# EAGLE design adc_40MHz_v3 (EAGLE 7.6.0)
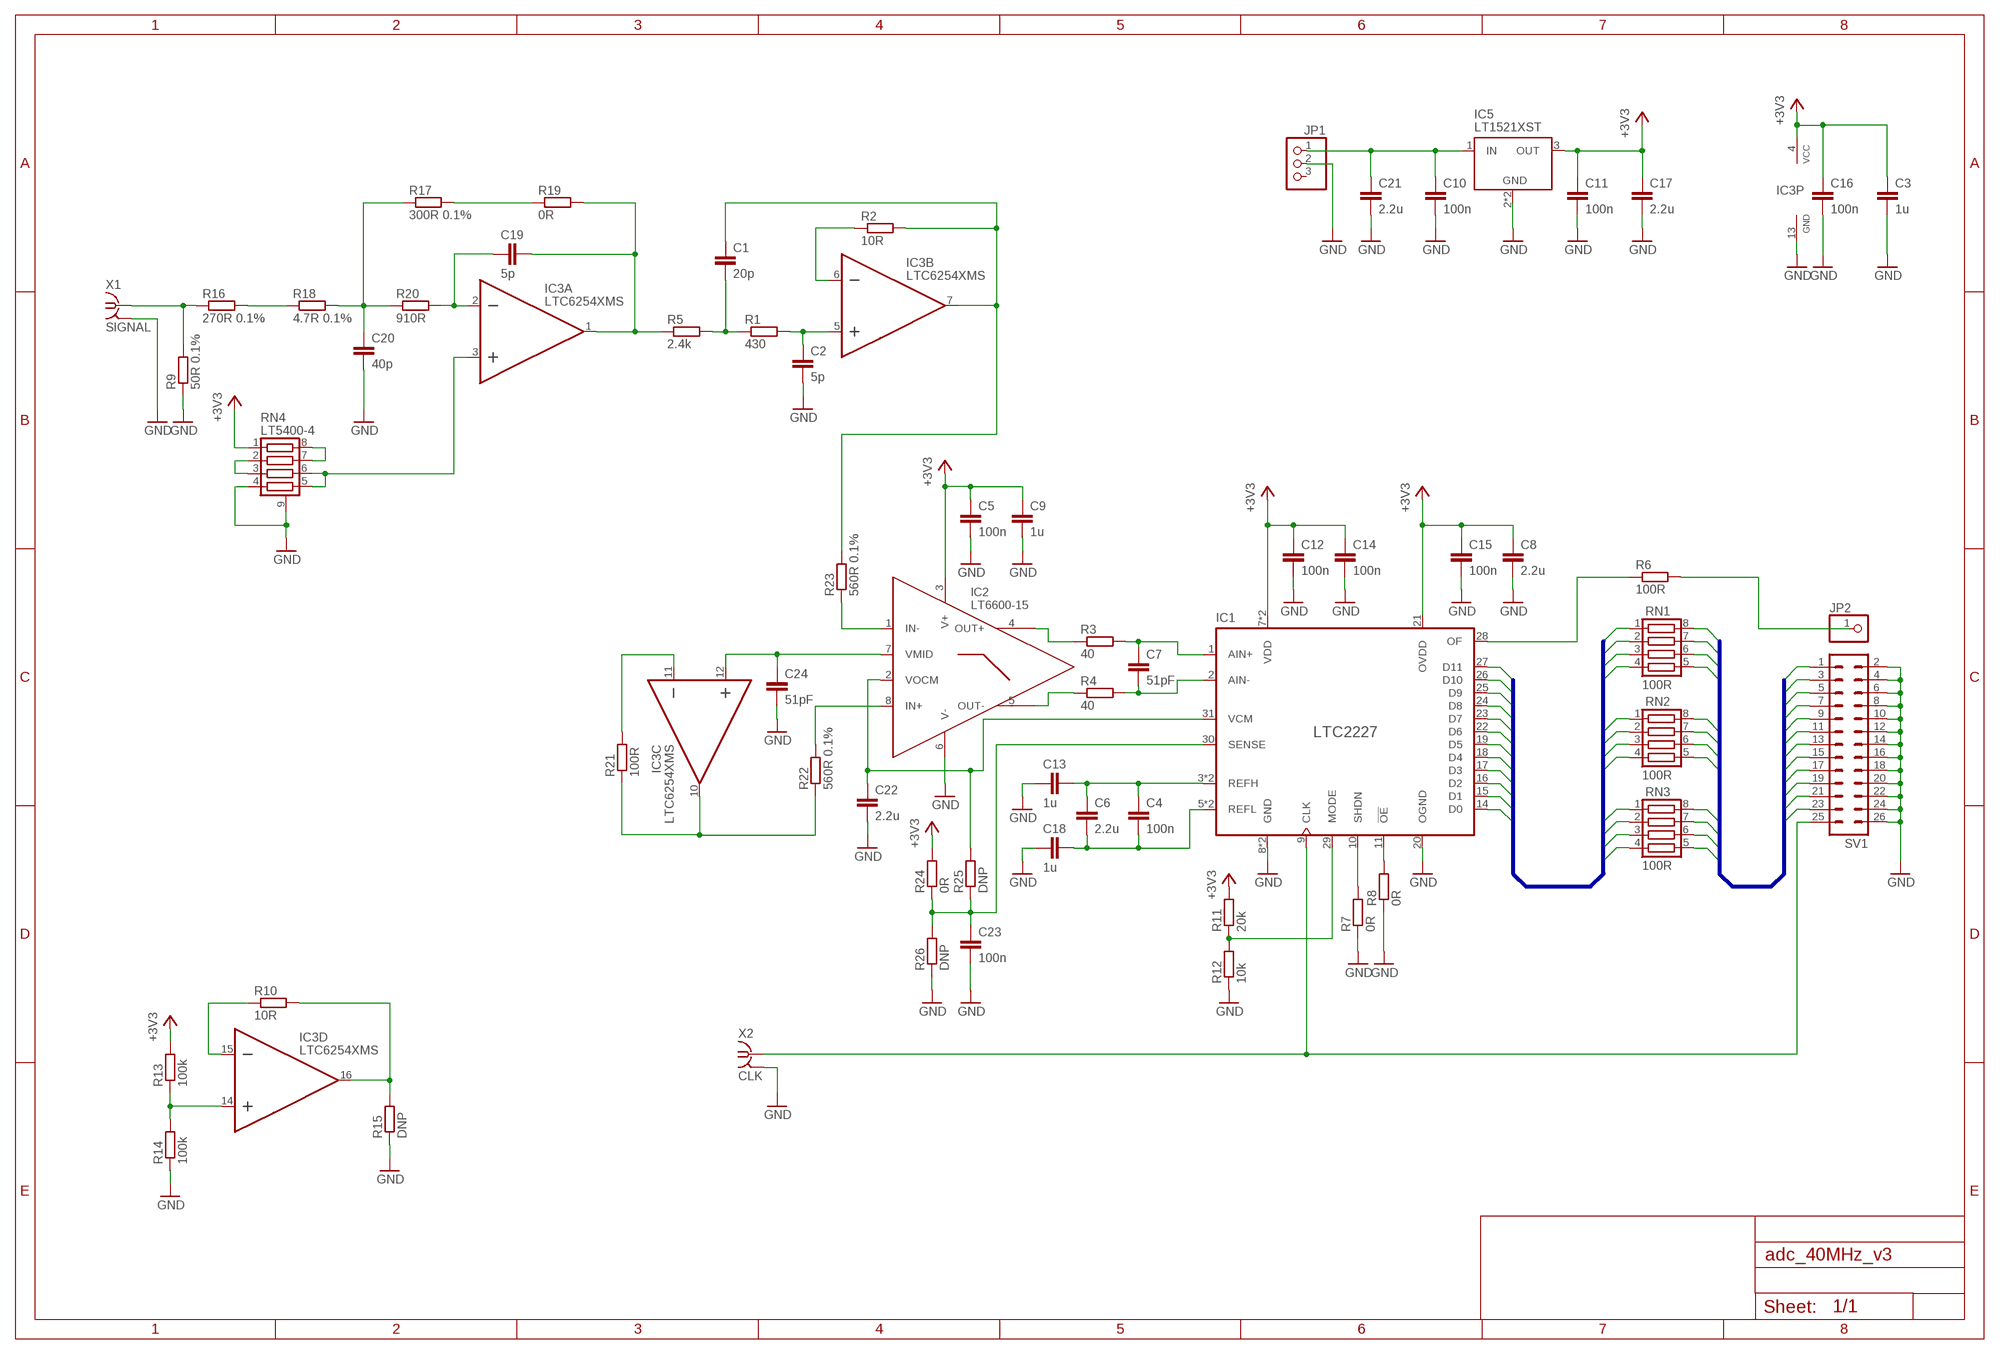
[diagram p0: schematic, sheet 1]

## Parts
C1  20p  C-EUC0603  [C0603]
C2  5p  C-EUC0603  [C0603]
C3  1u  C-EUC0805  [C0805]
C4  100n  C-EUC0603  [C0603]
C5  100n  C-EUC0603  [C0603]
C6  2.2u  C-EUC0805  [C0805]
C7  51pF  C-EUC0603  [C0603]
C8  2.2u  C-EUC0805  [C0805]
C9  1u  C-EUC0805  [C0805]
C10  100n  C-EUC0805  [C0805]
C11  100n  C-EUC0805  [C0805]
C12  100n  C-EUC0603  [C0603]
C13  1u  C-EUC0805  [C0805]
C14  100n  C-EUC0603  [C0603]
C15  100n  C-EUC0603  [C0603]
C16  100n  C-EUC0805  [C0805]
C17  2.2u  C-EUC0805  [C0805]
C18  1u  C-EUC0805  [C0805]
C19  5p  C-EUC0603  [C0603]
C20  40p  C-EUC0603  [C0603]
C21  2.2u  C-EUC0805  [C0805]
C22  2.2u  C-EUC0805  [C0805]
C23  100n  C-EUC0603  [C0603]
C24  51pF  C-EUC0603  [C0603]
IC1  LTC2227  [QFN32]
IC2  LT6600-15  [S8]
IC3  LTC6254XMS  [MSOP16]
IC5  LT1521XST  [SOT223]
JP1  PINHD-1X3/90  [1X03/90]
JP2  PINHD-1X1  [1X01]
R1  430  R-EU_R0603  [R0603]
R2  10R  R-EU_R0603  [R0603]
R3  40  R-EU_R0603  [R0603]
R4  40  R-EU_R0603  [R0603]
R5  2.4k  R-EU_R0603  [R0603]
R6  100R  R-EU_R0603  [R0603]
R7  0R  R-EU_R0603  [R0603]
R8  0R  R-EU_R0603  [R0603]
R9  50R 0.1%  R-EU_R0603  [R0603]
R10  10R  R-EU_R0603  [R0603]
R11  20k  R-EU_R0603  [R0603]
R12  10k  R-EU_R0603  [R0603]
R13  100k  R-EU_R0603  [R0603]
R14  100k  R-EU_R0603  [R0603]
R15  DNP  R-EU_R0603  [R0603]
R16  270R 0.1%  R-EU_R0603  [R0603]
R17  300R 0.1%  R-EU_R0603  [R0603]
R18  4.7R 0.1%  R-EU_R0603  [R0603]
R19  0R  R-EU_R0603  [R0603]
R20  910R  R-EU_R0603  [R0603]
R21  100R  R-EU_R0603  [R0603]
R22  560R 0.1%  R-EU_R0603  [R0603]
R23  560R 0.1%  R-EU_R0603  [R0603]
R24  0R  R-EU_R0603  [R0603]
R25  DNP  R-EU_R0603  [R0603]
R26  DNP  R-EU_R0603  [R0603]
RN1  100R  CTS742C083  [EXB38V]
RN2  100R  CTS742C083  [EXB38V]
RN3  100R  CTS742C083  [EXB38V]
RN4  LT5400-4  LT5400  [MS8E]
SV1  ML26  [ML26]
X1  SIGNAL  BU-SMA-H  [BU-SMA-H]
X2  CLK  BU-SMA-H  [BU-SMA-H]

## Nets
+3V3: C3.1 C5.1 C8.1 C9.1 C11.1 C12.1 C14.1 C15.1 C16.1 C17.1 IC1.7(VDD) IC1.21(OVDD) IC1.32(VDD) IC2.3(V+) IC3.4(P:V+) IC5.3(OUT) R11.2 R13.2 R24.2 RN4.1
ADC_D0: IC1.14(D0) RN3.4
ADC_D1: IC1.15(D1) RN3.3
ADC_D2: IC1.16(D2) RN3.2
ADC_D3: IC1.17(D3) RN3.1
ADC_D4: IC1.18(D4) RN2.4
ADC_D5: IC1.19(D5) RN2.3
ADC_D6: IC1.22(D6) RN2.2
ADC_D7: IC1.23(D7) RN2.1
ADC_D8: IC1.24(D8) RN1.4
ADC_D9: IC1.25(D9) RN1.3
ADC_D10: IC1.26(D10) RN1.2
ADC_D11: IC1.27(D11) RN1.1
CLK: IC1.9(CLK) SV1.25 X2.1
DAC_D0: RN3.5 SV1.23
DAC_D1: RN3.6 SV1.21
DAC_D2: RN3.7 SV1.19
DAC_D3: RN3.8 SV1.17
DAC_D4: RN2.5 SV1.15
DAC_D5: RN2.6 SV1.13
DAC_D6: RN2.7 SV1.11
DAC_D7: RN2.8 SV1.9
DAC_D8: RN1.5 SV1.7
DAC_D9: RN1.6 SV1.5
DAC_D10: RN1.7 SV1.3
DAC_D11: RN1.8 SV1.1
GND: C2.2 C3.2 C5.2 C8.2 C9.2 C10.2 C11.2 C12.2 C13.1 C14.2 C15.2 C16.2 C17.2 C18.1 C20.2 C21.2 C22.2 C23.2 C24.2 IC1.8(GND) IC1.20(OGND) IC1.33(GND) IC2.6(V-) IC3.13(P:V-) IC5.2(GND) IC5.4(GND) JP1.2 R7.1 R8.1 R9.1 R12.1 R14.1 R15.1 R26.1 RN4.4 RN4.9(EP) SV1.2 SV1.4 SV1.6 SV1.8 SV1.10 SV1.12 SV1.14 SV1.16 SV1.18 SV1.20 SV1.22 SV1.24 SV1.26 X1.2 X1.3 X1.4 X1.5 X2.2 X2.3 X2.4 X2.5
N$1: IC2.4(OUT+) R3.1
N$2: C7.1 IC1.1(AIN+) R3.2
N$3: C7.2 IC1.2(AIN-) R4.2
N$4: IC2.5(OUT-) R4.1
N$5: C22.1 IC1.31(VCM) IC2.2(VOCM) R25.2
N$6: IC1.28(OF) R6.1
N$7: C4.2 C6.2 C18.2 IC1.5(REFL) IC1.6(REFL)
N$8: JP2.1 R6.2
N$9: IC1.11(!OE) R8.2
N$10: IC1.10(SHDN) R7.2
N$11: R9.2 R16.1 X1.1
N$12: IC3.14(D:+IN) R13.1 R14.2
N$13: IC3.10(C:OUT) R21.1 R22.1
N$14: IC3.15(D:-IN) R10.1
N$15: IC3.16(D:OUT) R10.2 R15.2
N$16: RN4.7 RN4.8
N$17: IC3.11(C:-IN) R21.2
N$18: C24.1 IC2.7(VMID) IC3.12(C:+IN)
N$19: R16.2 R18.1
N$20: C20.1 R17.1 R18.2 R20.1
N$21: R17.2 R19.1
N$22: C19.2 IC3.1(A:OUT) R5.1 R19.2
N$23: C19.1 IC3.2(A:-IN) R20.2
N$24: IC3.3(A:+IN) RN4.5 RN4.6
N$25: RN4.2 RN4.3
N$26: IC3.6(B:-IN) R2.1
N$27: C1.1 IC3.7(B:OUT) R2.2 R23.2
N$28: C1.2 R1.1 R5.2
N$29: C2.1 IC3.5(B:+IN) R1.2
N$30: IC2.8(IN+) R22.2
N$31: IC2.1(IN-) R23.1
N$32: IC1.29(MODE) R11.1 R12.2
N$33: C4.1 C6.1 C13.2 IC1.3(REFH) IC1.4(REFH)
N$35: C23.1 IC1.30(SENSE) R24.1 R25.1 R26.2
VIN: C10.1 C21.1 IC5.1(IN) JP1.1
Unconnected: JP1.3

## Buses
ADC_D[0..11]
DAC_D[0..11]

## Library data of the parts
C1-C24 = rcl:C-EU: CAPACITOR, European symbol
IC1 = ltc22xx:LTC2227: 12-Bit, 40Msps Low Power 3V ADC
IC2 = lt6600:LT6600-15: Very Low Noise, Differential Amplifier and 15MHz Lowpass Filter
IC3 = ltc625x:LTC6254X
IC5 = lt1521:LT1521XST
JP1 = pinhead:PINHD-1X3: PIN HEADER
JP2 = pinhead:PINHD-1X1: PIN HEADER
R1-R26 = rcl:R-EU_: RESISTOR, European symbol
RN1-RN3 = passive:CTS742C083: Chip Resistor Array 4 Single Resistor Source: http://www.ctscorp.com/components/Datasheets/CTSChipArrayDs.pdf
RN4 = lt5400:LT5400
SV1 = con-harting-ml:ML26: HARTING; OC_FARNELL: unknown; OC_NEWARK: unknown
X1 X2 = con-coax:BU-SMA-H: FEMALE SMA CONNECTOR Radiall; OC_FARNELL: unknown; OC_NEWARK: unknown

## Board
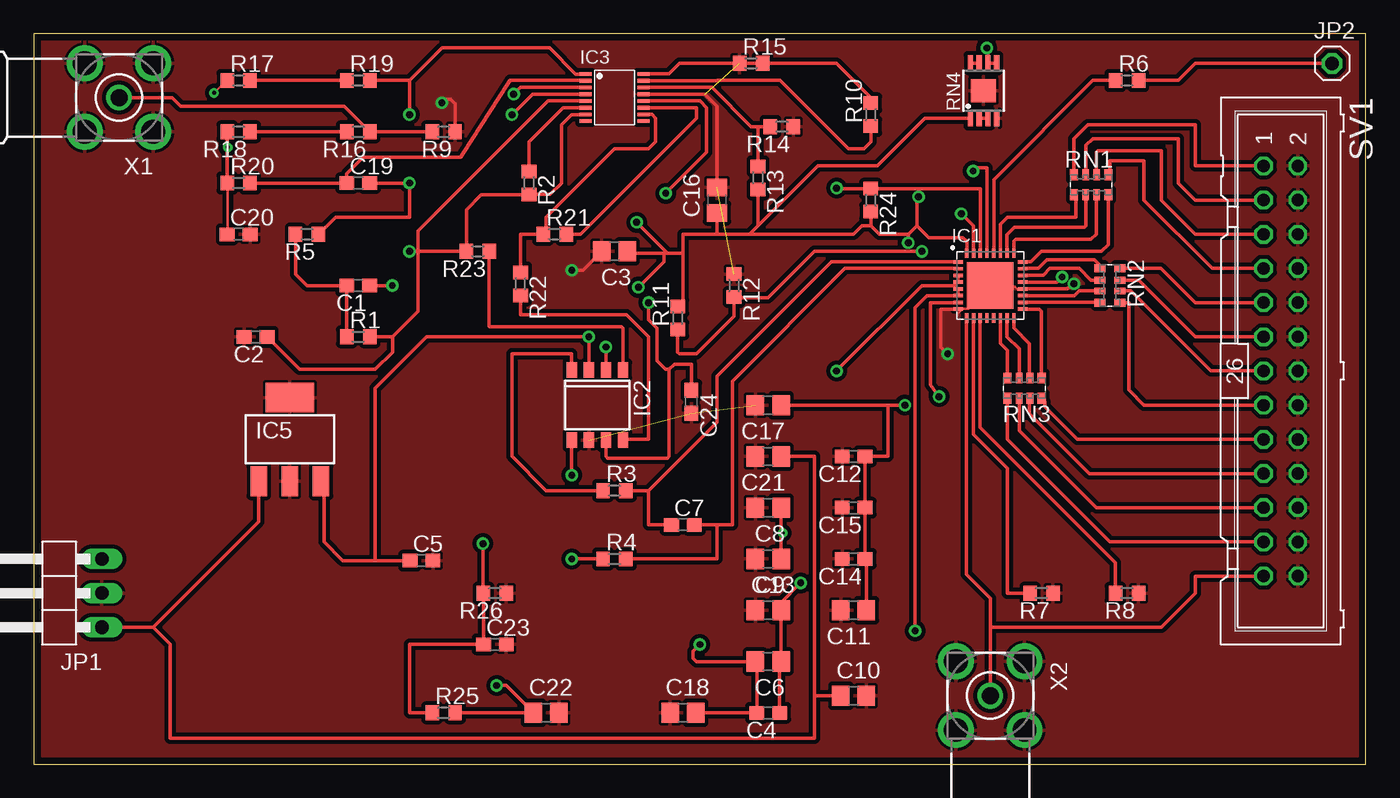
[diagram p1: board, top side]
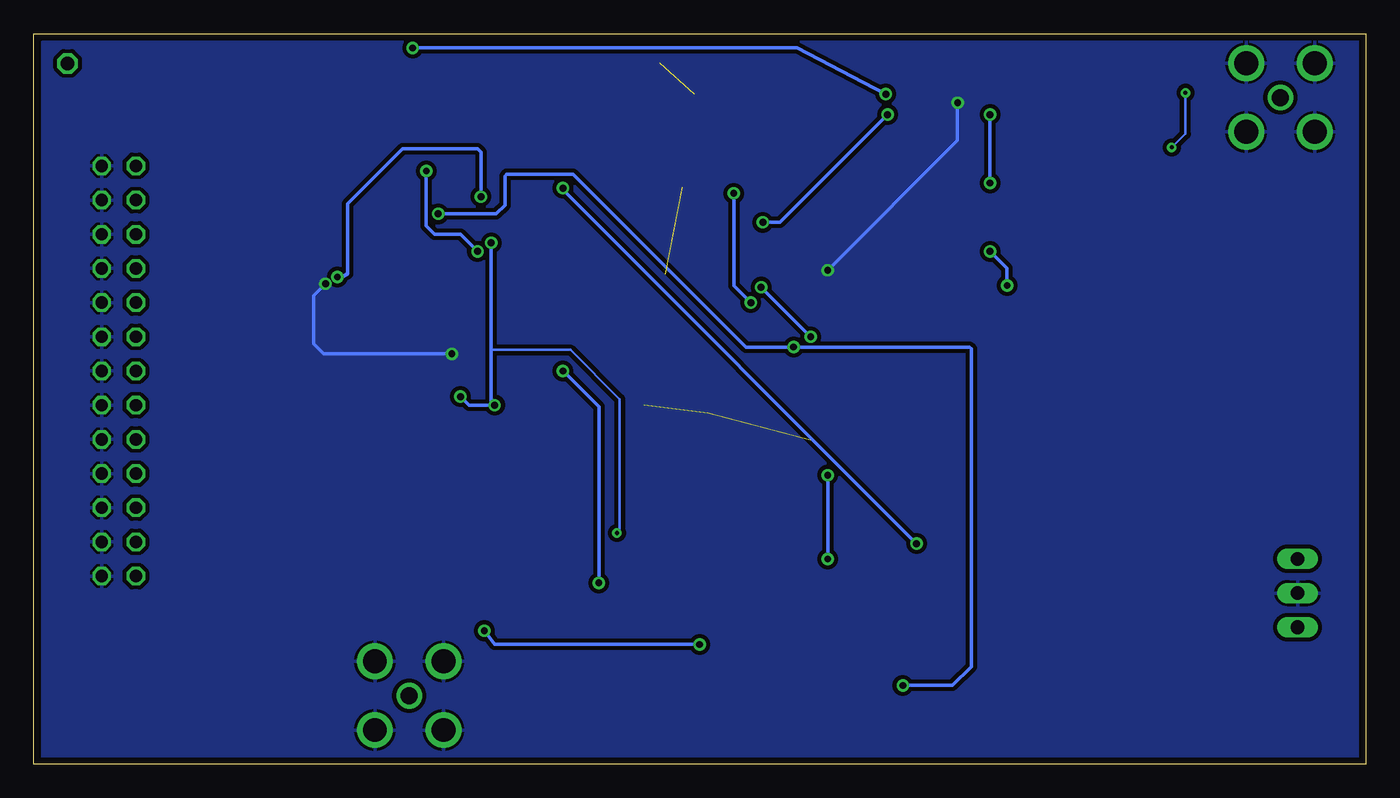
[diagram p2: board, bottom side, seen from below]

Size 99.04 x 54.28 mm. Coordinates in mm from the lower left corner, seen from the top.
Outline: 0,0 99.04,0 99.04,54.28 0,54.28 0,0
Copper layers (1*2+16): Top 0.035mm / dielectric 1.5mm / Route2 0.035mm / dielectric 0.15mm / Bottom 0.035mm
Design rules "satland_standard": minimum track width 8mil, minimum drill 0.3mm, track to track 8mil, track to pad 8mil, pad to pad 8mil, via to via 8mil, smd to smd 0mil, copper to edge 20mil, drill to drill 10mil, minimum pad ring 8mil, minimum via ring 8mil, stop-mask expansion 4mil, vias tented up to drill 0mil, thermal gap 8mil

### Footprints (pad centres in the part's own frame; a part is rotated, then mirrored left to right if it is on the bottom)
C0603 = smd 1.1 x 1: 1 -0.85,0; 2 0.85,0
C0805 = smd 1.3 x 1.5: 1 -0.95,0; 2 0.95,0
QFN32 = smd 0.7 x 0.25: 1 -2.4,1.75; 2 -2.4,1.25; 3 -2.4,0.75; 4 -2.4,0.25; 5 -2.4,-0.25; 6 -2.4,-0.75; 7 -2.4,-1.25; 8 -2.4,-1.75; 17 2.4,-1.75; 18 2.4,-1.25; 19 2.4,-0.75; 20 2.4,-0.25; 21 2.4,0.25; 22 2.4,0.75; 23 2.4,1.25; 24 2.4,1.75 | smd 0.25 x 0.7: 9 -1.75,-2.4; 10 -1.25,-2.4; 11 -0.75,-2.4; 12 -0.25,-2.4; 13 0.25,-2.4; 14 0.75,-2.4; 15 1.25,-2.4; 16 1.75,-2.4; 25 1.75,2.4; 26 1.25,2.4; 27 0.75,2.4; 28 0.25,2.4; 29 -0.25,2.4; 30 -0.75,2.4; 31 -1.25,2.4; 32 -1.75,2.4 | smd 3.45 x 3.45: 33 0,0
S8 = smd 0.762 x 1.143: 1 -1.905,-2.6; 2 -0.635,-2.6; 3 0.635,-2.6; 4 1.905,-2.6; 5 1.905,2.6; 6 0.635,2.6; 7 -0.635,2.6; 8 -1.905,2.6
MSOP16 = smd 0.275 x 0.9: 1 -1.75,-2.15; 2 -1.25,-2.15; 3 -0.75,-2.15; 4 -0.25,-2.15; 5 0.25,-2.15; 6 0.75,-2.15; 7 1.25,-2.15; 8 1.75,-2.15; 9 1.75,2.15; 10 1.25,2.15; 11 0.75,2.15; 12 0.25,2.15; 13 -0.25,2.15; 14 -0.75,2.15; 15 -1.25,2.15; 16 -1.75,2.15
SOT223 = smd 1.219 x 2.235: 1 -2.311,-3.099; 2 0,-3.099; 3 2.311,-3.099 | smd 3.6 x 2.2: 4 0,3.099
1X03/90 = drill 1.016 long: 1 -2.54,-3.81; 2 0,-3.81; 3 2.54,-3.81
1X01 = drill 1.016 octagon: 1 0,0
R0603 = smd 1 x 1.1: 1 -0.85,0; 2 0.85,0
EXB38V = smd 0.6 x 0.8: 1 -1.275,-0.75; 4 1.275,-0.75; 5 1.275,0.75; 8 -1.275,0.75 | smd 0.5 x 0.8: 2 -0.4,-0.75; 3 0.4,-0.75; 6 0.4,0.75; 7 -0.4,0.75
MS8E = smd 0.4 x 1.2: 1 -0.975,-2.05; 2 -0.325,-2.05; 3 0.325,-2.05; 4 0.975,-2.05; 5 0.975,2.05; 6 0.325,2.05; 7 -0.325,2.05; 8 -0.975,2.05 | smd 1.88 x 1.68: 9 0,0
ML26 = drill 0.914 octagon: 1 -15.24,-1.27; 2 -15.24,1.27; 3 -12.7,-1.27; 4 -12.7,1.27; 5 -10.16,-1.27; 6 -10.16,1.27; 7 -7.62,-1.27; 8 -7.62,1.27; 9 -5.08,-1.27; 10 -5.08,1.27; 11 -2.54,-1.27; 12 -2.54,1.27; 13 0,-1.27; 14 0,1.27; 15 2.54,-1.27; 16 2.54,1.27; 17 5.08,-1.27; 18 5.08,1.27; 19 7.62,-1.27; 20 7.62,1.27; 21 10.16,-1.27; 22 10.16,1.27; 23 12.7,-1.27; 24 12.7,1.27; 25 15.24,-1.27; 26 15.24,1.27
BU-SMA-H = drill 1.27: 1 0,0 | drill 1.778: 2 -2.55,2.55; 3 2.55,2.55; 4 2.55,-2.55; 5 -2.55,-2.55

### Placement (x,y rotation side)
C1  24.13,35.56 180 top
C2  16.51,31.75 180 top
C3  43.18,38.1 180 top
C4  54.61,3.81 180 top
C5  28.83,15.11 0 top
C6  54.61,7.62 180 top
C7  48.26,17.78 0 top
C8  54.61,19.05 180 top
C9  54.61,15.24 180 top
C10  60.96,5.08 0 top
C11  60.96,11.43 180 top
C12  60.96,22.86 180 top
C13  54.61,11.43 0 top
C14  60.96,15.24 180 top
C15  60.96,19.05 180 top
C16  50.8,41.91 90 top
C17  54.61,26.67 180 top
C18  48.26,3.81 0 top
C19  24.13,43.18 0 top
C20  15.24,39.37 0 top
C21  54.61,22.86 180 top
C22  38.1,3.81 0 top
C23  34.29,8.89 0 top
C24  48.9,26.92 270 top
IC1  71.12,35.56 0 top
IC2  41.91,26.67 180 top
IC3  43.18,49.53 270 top
IC5  19.05,24.13 0 top
JP1  1.27,12.7 90 top
JP2  96.52,52.07 0 top
R1  24.13,31.75 0 top
R2  36.83,43.18 270 top
R3  43.18,20.32 0 top
R4  43.18,15.24 0 top
R5  20.32,39.37 180 top
R6  81.28,50.8 0 top
R7  74.93,12.7 180 top
R8  81.28,12.7 180 top
R9  30.48,46.99 180 top
R10  62.23,48.26 90 top
R11  47.88,33.15 90 top
R12  52.07,35.56 270 top
R13  53.85,43.56 270 top
R14  55.63,47.37 180 top
R15  53.34,52.07 0 top
R16  24.13,46.99 180 top
R17  15.24,50.8 0 top
R18  15.24,46.99 180 top
R19  24.13,50.8 0 top
R20  15.24,43.18 0 top
R21  38.73,39.37 0 top
R22  36.2,35.69 270 top
R23  33.02,38.1 180 top
R24  62.23,41.91 270 top
R25  30.48,3.81 0 top
R26  34.29,12.7 180 top
RN1  78.61,43.05 0 top
RN2  80.01,35.56 270 top
RN3  73.66,27.94 180 top
RN4  70.61,50.04 0 top
SV1  92.71,29.21 270 top
X1  6.35,49.53 180 top
X2  71.12,5.08 270 top

### Tracks (layer width: path | path; a pad name or v marks a point on that pad's centre or on a via)
+3V3  (via drill 0.3, 0.51)
  Top 0.203: v55.68,17.17 55.56,17.17
  Top 0.254: 25.4,15.11 C5.1 | C11.1 61.91,15.14 C14.1 C15.1 C12.1 63.5,22.86 63.5,26.67 | C8.1 55.56,17.17 C9.1 | C17.1 63.5,26.67 | 50.8,39.37 48.26,39.37 48.26,37.97 | 50.8,39.37 53.21,39.37 53.28,39.43 | 53.28,39.43 53.85,40 | 53.85,40 R13.2 | 69.34,37.99 IC1.32 69.37,38.83 69.09,39.12 66.55,39.12 65.66,40 | R24.2 62.23,40 | 53.28,39.43 53.34,39.37 60.96,39.37 61.59,40 62.23,40 | RN4.1 66.28,47.99 62.74,44.45 58.29,44.45 53.85,40 | IC2.3 v41.27,31.75 29.21,31.75 25.4,27.94 25.4,15.11 | C3.1 44.26,37.97 46.86,37.97 | 46.86,37.97 47.12,37.97 | 47.12,37.97 48.26,37.97 | R11.2 48.26,34.38 48.26,37.97 | IC1.21 76.07,35.81 v76.45,36.2 | IC3.4 37.08,49.78 v35.56,48.26 | v44.83,40.26 47.12,37.97 | v44.96,35.43 46.86,37.34 46.86,37.97 | C16.1 50.8,39.37 | IC5.3 21.59,20.8 21.59,16.51 22.99,15.11 25.4,15.11 | IC1.7 68.7,34.29 66.67,34.29 66.67,28.19 v67.31,27.3 | v64.77,26.67 63.5,26.67 | v65.79,42.16 65.66,42.04 65.66,40 | 65.66,40 65.02,39.37 | v65.02,38.73 65.02,39.37 | 62.23,40 62.87,39.37 65.02,39.37
  Bottom 0.203: v55.68,17.17 55.47,17.17 55.47,27.13 59.13,30.79 65.02,30.79
  Bottom 0.254: v35.56,48.26 43.56,40.26 v44.83,40.26 | v41.27,31.75 v44.96,35.43 | v65.79,42.16 65.79,45.47 66.04,45.72 71.63,45.72 75.69,41.66 75.69,36.45 76.07,36.2 v76.45,36.2 | v67.31,27.3 66.67,26.67 v64.77,26.67 65.02,26.92 65.02,30.79 v65.02,38.73
ADC_D0
  Top 0.254: IC1.14 71.87,31.25 72.39,30.73 RN3.4
ADC_D1
  Top 0.254: IC1.15 72.37,31.77 73.28,30.86 73.28,28.71 RN3.3
ADC_D2
  Top 0.254: IC1.16 72.87,32.41 74.04,31.24 74.04,28.71 RN3.2
ADC_D3
  Top 0.254: IC1.17 74.78,33.81 74.93,33.66 RN3.1
ADC_D4
  Top 0.254: IC1.18 79.23,34.31 RN2.4
ADC_D5
  Top 0.254: IC1.19 77.36,34.81 77.72,35.18 79.24,35.18 RN2.3
ADC_D6
  Top 0.254: 79.24,35.94 RN2.2 78.59,35.96 77.72,36.83 75.56,36.83 75.06,36.32 73.53,36.32 IC1.22
ADC_D7
  Top 0.254: 79.23,36.81 RN2.1 79.26,37.07 78.87,37.47 75.31,37.47 74.68,36.83 73.54,36.83 IC1.23
ADC_D8
  Top 0.254: IC1.24 74.14,37.31 74.93,38.1 79.38,38.1 79.88,38.61 RN1.4
ADC_D9
  Top 0.254: IC1.25 72.87,38.83 73.03,38.99 78.61,38.99 78.99,39.37 78.99,42.28 RN1.3
ADC_D10
  Top 0.254: IC1.26 72.37,39.35 72.9,39.88 78.11,39.88 78.23,40 78.23,42.28 RN1.2
ADC_D11
  Top 0.254: IC1.27 71.87,40.12 72.39,40.64 77.47,40.64 77.47,42.17 RN1.1
CLK
  Top 0.254: X2.1 71.12,10.16 | 71.12,10.16 71.12,12.32 69.34,14.1 69.34,33.13 IC1.9 | SV1.25 86.36,13.97 86.36,12.7 83.82,10.16 71.12,10.16
DAC_D0
  Top 0.254: SV1.23 80.01,16.51 72.39,24.13 RN3.5
DAC_D1
  Top 0.254: SV1.21 78.99,19.05 73.28,24.76 73.28,27.17 RN3.6
DAC_D2
  Top 0.254: SV1.19 78.49,21.59 74.04,26.04 74.04,27.17 RN3.7
DAC_D3
  Top 0.254: SV1.17 77.6,24.13 75.18,26.54 75.18,26.94 RN3.8
DAC_D4
  Top 0.254: RN2.5 81.4,34.28 81.41,34.29 81.41,27.81 82.55,26.67 SV1.15
DAC_D5
  Top 0.254: RN2.6 81.55,35.16 87.5,29.21 SV1.13
DAC_D6
  Top 0.254: RN2.7 82.15,35.96 86.36,31.75 SV1.11
DAC_D7
  Top 0.254: RN2.8 83.81,36.84 86.36,34.29 SV1.9
DAC_D8
  Top 0.254: SV1.7 87.63,36.83 82.55,41.91 82.55,44.83 80.01,44.83 80.01,43.92 RN1.5
DAC_D9
  Top 0.254: SV1.5 86.36,39.37 83.82,41.91 83.82,45.59 79.12,45.59 78.99,45.47 78.99,43.82 RN1.6
DAC_D10
  Top 0.254: SV1.3 86.36,41.91 85.09,43.18 85.09,46.48 78.74,46.48 78.23,45.97 78.23,43.82 RN1.7
DAC_D11
  Top 0.254: SV1.1 86.36,44.45 86.36,47.5 78.36,47.5 77.34,46.48 RN1.8
GND  (via drill 0.51)  (4 unrouted)
  Top 0.203: 71.12,35.46 72.95,35.46 73.15,35.25 73.36,35.25 IC1.20 | 71.12,35.46 69.49,33.83 69.09,33.83 68.68,33.43 68.68,33.36 | 71.12,35.46 IC1.33
  Top 0.254: IC3.13 49.91,49.78 50.8,48.89 C16.2 | C3.2 40.83,36.7 v40.01,36.7 | v30.35,49.15 30.61,49.4 30.99,49.4 31.33,49.06 R9.1 | IC1.20 76.83,35.31 77.22,35.69 v77.34,35.69 | v67.94,30.48 67.47,30.96 67.47,33.81 IC1.8
  Bottom 0.254: v40.01,36.7 30.35,46.36 v30.35,49.15 | v77.34,35.69 78.23,34.8 78.23,31.24 77.47,30.48 v67.94,30.48
  pour Top (isolate 0.305): 0.64,53.72 98.68,53.85 98.42,0.63 0.64,0.63
  pour Bottom (isolate 0.305): 0.51,53.72 98.3,53.72 98.42,53.59 98.42,0.51 0.51,0.51
N$1
  Top 0.254: R3.1 38.1,20.32 35.56,22.86 35.56,30.48 40.01,30.48 IC2.4
N$2
  Top 0.254: 45.72,20.32 45.72,17.78 C7.1 | R3.2 45.72,20.32 | IC1.1 68.69,37.34 59.31,37.34 50.8,28.83 50.8,25.4 45.72,20.32
N$3
  Top 0.254: R4.2 50.8,15.24 50.8,17.78 C7.2 51.94,17.78 51.94,28.45 60.33,36.83 68.7,36.83 IC1.2
N$4  (via drill 0.51)
  Top 0.254: R4.1 v40.01,15.24 | v40.01,21.46 IC2.5
  Bottom 0.254: v40.01,15.24 v40.01,21.46
N$5  (via drill 0.51)
  Top 0.254: R25.2 C22.1 35.12,5.84 v34.42,5.84 | v42.55,30.99 IC2.2 | IC1.31 69.85,37.98 69.85,40 v68.96,40.89
  Bottom 0.254: v34.42,5.84 30.73,5.84 29.34,7.24 29.34,30.86 29.46,30.99 v42.55,30.99 46.1,30.99 58.93,43.81 63.88,43.81 64.01,43.69 64.01,41.53 64.64,40.89 v68.96,40.89
N$6
  Top 0.254: IC1.28 71.37,43.43 78.74,50.8 R6.1
N$7  (via drill 0.51)
  Top 0.254: C18.2 C4.2 53.76,7.52 C6.2 49.28,7.62 49.02,7.87 49.02,8.38 v49.53,8.89 | IC1.5 IC1.6 68.71,34.8 66.42,34.8 65.53,33.91 v65.53,9.91
  Bottom 0.254: v65.53,9.91 64.77,8.89 v49.53,8.89
N$8
  Top 0.254: R6.2 85.09,50.8 86.36,52.07 JP2.1
N$9
  Top 0.254: R8.2 80.43,14.95 70.36,25.02 70.36,33.15 IC1.11
N$10
  Top 0.254: R7.2 72.39,12.7 72.39,21.97 69.85,24.51 69.85,33.14 IC1.10
N$11
  Top 0.254: X1.1 10.29,49.53 10.92,48.89 23.07,48.89 R16.1 R9.2
N$12
  Top 0.254: R14.2 53.85,47.37 | 53.85,47.37 R13.1 | IC3.14 50.43,50.28 53.34,47.37 53.85,47.37
N$13
  Top 0.254: 36.49,36.83 R22.1 36.2,39.37 R21.1 38.1,39.59 38.1,40.64 43.18,45.72 45.72,45.72 46.23,46.23 46.23,48.01 45.95,48.28 IC3.10
N$14
  Top 0.254: IC3.15 50.82,50.78 50.84,50.8 55.5,50.8 60.58,45.72 61.72,45.72 62.23,46.23 R10.1
N$15
  Top 0.254: R10.2 62.23,49.53 59.69,52.07 R15.2 48.01,52.07 47.24,51.31 45.36,51.31 IC3.16
N$16
  Top 0.254: RN4.8 RN4.7
N$17
  Top 0.254: R21.2 40.64,39.37 49.26,47.99 49.26,48.78 IC3.11
N$18  (via drill 0.51)
  Top 0.254: IC2.7 42.55,22.86 42.67,22.73 47.12,22.73 47.24,22.86 47.24,29.34 | 47.24,29.34 47.62,29.72 48.9,29.72 C24.1 | IC3.12 49.53,49.28 50.04,48.77 50.04,45.47 v46.99,42.42 | v45.72,34.29 45.72,33.02 46.35,32.39 46.35,29.97 46.99,29.34 47.24,29.34
  Bottom 0.254: v46.99,42.42 46.99,35.56 v45.72,34.29
N$19
  Top 0.254: R16.2 R18.1
N$20  (via drill 0.3)
  Top 0.203: C20.1 14.43,39.52 14.43,43.18 R20.1 | v13.41,49.89 14.22,50.7 R17.1 | v14.43,45.82 14.39,45.82
  Top 0.254: R18.2 14.39,45.82 R20.1
  Bottom 0.203: v13.41,49.89 13.41,46.84 v14.43,45.82
N$21
  Top 0.254: R17.2 R19.1
N$22  (via drill 0.51)
  Top 0.254: R19.2 27.94,50.8 | 41,51.31 IC3.1 40.29,51.28 38.35,53.21 30.35,53.21 27.94,50.8 | C19.2 v27.94,43.18 27.94,40.64 22.44,40.64 R5.1 | v27.94,48.26 27.94,50.8
  Bottom 0.254: v27.94,43.18 v27.94,48.26
N$23
  Top 0.254: R20.2 C19.1 23.28,43.85 24.51,45.09 31.75,45.09 35.43,50.8 41.01,50.8 IC3.2
N$24  (via drill 0.51)
  Top 0.254: 41.02,50.29 IC3.3 36.18,50.28 v35.69,49.78 | v70.87,53.21 70.94,53.14 RN4.6 RN4.5
  Bottom 0.254: v35.69,49.78 42.29,53.21 v70.87,53.21
N$25
  Top 0.254: RN4.2 RN4.3
N$26
  Top 0.254: R2.1 36.83,46.23 39.37,48.77 41.02,48.77 IC3.6
N$27  (via drill 0.51)
  Top 0.254: IC3.7 41.01,48.26 40.01,48.26 39.24,47.5 39.24,43.18 38.39,42.33 R2.2 36.79,42.29 33.27,42.29 32.17,41.19 R23.2 v27.94,38.1 | v26.67,35.56 C1.1
  Bottom 0.254: v27.94,38.1 26.67,36.83 v26.67,35.56
N$28
  Top 0.254: R5.2 19.47,36.41 20.32,35.56 C1.2 R1.1
N$29
  Top 0.254: R1.2 26.67,31.75 | 26.67,31.75 28.57,33.66 28.57,39.62 38.23,49.28 IC3.5 | C2.1 19.77,29.34 25.4,29.34 26.67,30.61 26.67,31.75
N$30
  Top 0.254: IC2.8 43.88,24.13 45.72,24.13 45.72,31.75 44.07,33.4 36.2,33.4 R22.2
N$31
  Top 0.254: IC2.1 43.81,32.39 43.69,32.51 33.91,32.51 33.87,32.55 R23.1
N$32  (via drill 0.51)
  Top 0.254: R11.1 47.88,30.61 48.01,30.48 49.28,30.48 52.07,33.27 R12.2 52.11,34.67 54.61,34.67 58.04,38.1 v66.04,38.1 | v69.85,44.07 70.1,44.32 70.87,44.32 IC1.29
  Bottom 0.254: v66.04,38.1 67.31,39.37 69.22,39.37 69.85,40 v69.85,44.07
N$33  (via drill 0.51)
  Top 0.254: C4.1 55.46,7.52 C6.1 C13.2 55.56,12 v57.02,13.46 | IC1.3 IC1.4 68.47,35.56 66.04,35.56 v59.69,29.21
  Bottom 0.254: v59.69,29.21 57.02,26.54 v57.02,13.46
N$35  (via drill 0.51)
  Top 0.254: IC1.30 70.36,37.97 70.4,38.01 70.4,42.76 R24.1 59.73,42.76 v59.69,42.8 | R25.1 27.94,3.81 27.94,8.89 C23.1 R26.2 33.4,12.74 v33.4,16.38
  Bottom 0.254: v33.4,16.38 59.69,42.67 v59.69,42.8
VIN
  Top 0.254: C21.1 58.04,22.86 58.04,5.08 | 58.04,5.08 C10.1 | 58.04,5.08 58.04,1.9 10.16,1.9 10.16,8.89 8.89,10.16 | JP1.1 8.89,10.16 | 8.89,10.16 16.74,18.01 IC5.1